# EAGLE design rev1 (EAGLE 7.1.0)
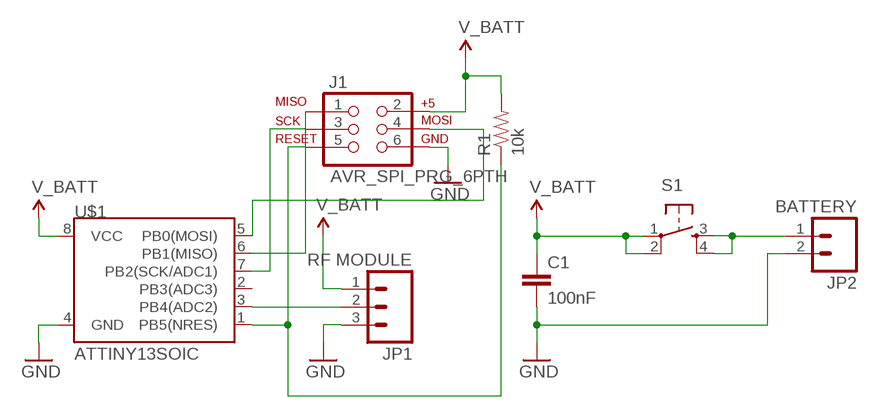
[diagram p0: schematic, sheet 1]

## Parts
C1  100nF  CAP1206  [1206]
J1  AVR_SPI_PRG_6PTH  [2X3]
JP1  RF MODULE  M03PTH  [1X03]
JP2  BATTERY  M02PTH  [1X02]
R1  10k  RESISTOR1206  [1206]
S1  TAC_SWITCHPTH  [TACTILE-PTH]
U$1  ATTINY13SOIC  [SO08]

## Nets
GND: C1.2 J1.6 JP1.3 JP2.2 U$1.4(GND)
N$1: JP1.2 U$1.3(PB4(ADC2))
N$3: JP2.1 S1.3 S1.4
N$4: J1.5 R1.1 U$1.1(PB5(NRES))
N$5: J1.3 U$1.7(PB2(SCK/ADC1))
N$6: J1.1 U$1.6(PB1(MISO))
N$7: J1.4 U$1.5(PB0(MOSI))
V_BATT: C1.1 J1.2 JP1.1 R1.2 S1.1 S1.2 U$1.8(VCC)
Unconnected: U$1.2(PB3(ADC3))

## Library data of the parts
C1 = SparkFun-Capacitors:CAP: Capacitor Standard 0603 ceramic capacitor, and 0.1" leaded capacitor.
J1 = SparkFun-Connectors:AVR_SPI_PRG_6: AVR ISP 6 Pin This is the reduced ISP connector for AVR programming. Common on Arduino. This footprint will take up less PCB space and can be used with a 10-pin to 6-pin adapter such as SKU: BOB-08508 **Special note about "TEST_POINT" package. The stop mask is on the top side, so if you want your programming test points to be on the bottom of your board, make sure to place this package on the bottom side of the board. This also ensure that the orientation to program from the bottom side will be correct.
JP1 = SparkFun-Connectors:M03: Header 3 Standard 3-pin 0.1" header. Use with straight break away headers (SKU : PRT-00116), right angle break away headers (PRT-00553), swiss pins (PRT-00743), machine pins (PRT-00117), and female headers (PRT-00115). Molex polarized connector foot print use with SKU : PRT-08232 with associated crimp pins and housings.
JP2 = SparkFun-Connectors:M02: Standard 2-pin 0.1" header. Use with - straight break away headers ( PRT-00116) - right angle break away headers (PRT-00553) - swiss pins (PRT-00743) - machine pins (PRT-00117) - female headers (PRT-00115) Molex polarized connector foot print use with: PRT-08233 with associated crimp pins and housings. 2.54_SCREWTERM for use with PRT-10571. 3.5mm Screw Terminal footprints for PRT-08084 5mm Screw Terminal footprints for use with PRT-08432
R1 = SparkFun-Resistors:RESISTOR: Resistor Basic schematic elements and footprints for 0603, 1206, and PTH resistors.
S1 = SparkFun-Electromechanical:TAC_SWITCH: Momentary Switch Button commonly used for reset or general input. Spark Fun Electronics SKU : COM-00097 SMT- SWCH-08247
U$1 = SparkFun-DigitalIC:ATTINY13: Atmel 8-pin 1kB flash uC

## Board
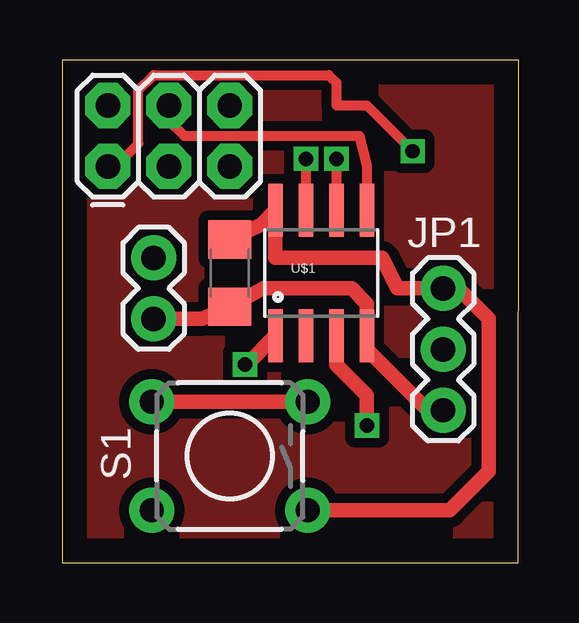
[diagram p1: board, top side]
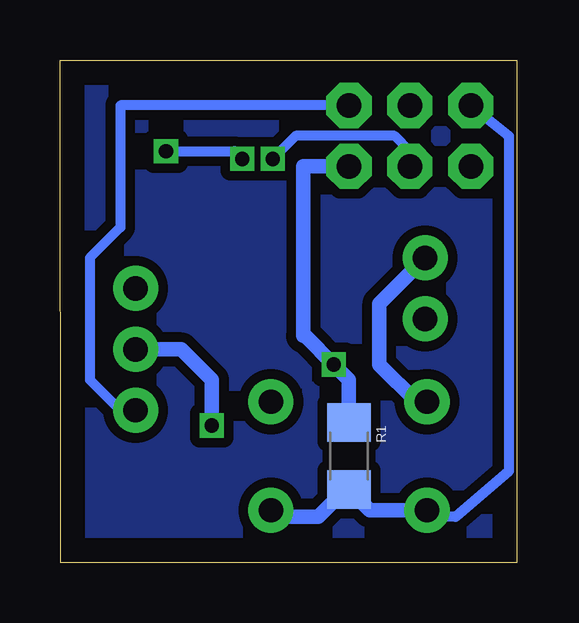
[diagram p2: board, bottom side, seen from below]

Size 19.02 x 20.95 mm. Coordinates in mm from the lower left corner, seen from the top.
Outline: 0,0 19,0 19.02,20.95 0,20.95 0,0
Copper layers (1*16): Top 0.035mm / dielectric 1.5mm / Bottom 0.035mm
Design rules "default": minimum track width 10mil, minimum drill 24mil, track to track 8mil, track to pad 8mil, pad to pad 8mil, via to via 8mil, smd to smd 8mil, copper to edge 40mil, drill to drill 8mil, minimum pad ring 10mil, minimum via ring 8mil, stop-mask expansion 4mil, vias tented up to drill 0mil, thermal gap 10mil

### Footprints (pad centres in the part's own frame; a part is rotated, then mirrored left to right if it is on the bottom)
1206 = smd 1.6 x 1.8: 1 -1.4,0; 2 1.4,0
2X3 = drill 1.016 pad 1.88 octagon: 1 0,0; 2 0,2.54; 3 2.54,0; 4 2.54,2.54; 5 5.08,0; 6 5.08,2.54
1X03 = drill 1.016 pad 1.88: 1 0,0; 2 2.54,0; 3 5.08,0
1X02 = drill 1.016 pad 1.88: 1 0,0; 2 2.54,0
TACTILE-PTH = drill 1.016 pad 1.88: 1 -3.251,2.261; 2 3.251,2.261; 3 -3.251,-2.261; 4 3.251,-2.261
SO08 = smd 0.61 x 2.21: 1 -1.905,-2.616; 2 -0.635,-2.616; 3 0.635,-2.616; 4 1.905,-2.616; 5 1.905,2.616; 6 0.635,2.616; 7 -0.635,2.616; 8 -1.905,2.616

### Placement (x,y rotation side)
C1  6.99,12.06 270 top
J1  1.91,16.51 0 top
JP1  15.88,11.43 270 top
JP2  3.81,12.7 270 top
R1  6.99,4.45 270 bottom
S1  6.99,4.45 180 top
U$1  10.79,12.06 0 top

### Tracks (layer width: path | path; a pad name or v marks a point on that pad's centre or on a via)
GND
  Top 0.61: JP2.2 5.84,10.16 C1.2 8.38,11.43 12.06,11.43 12.7,10.79 U$1.4 12.7,8.89 15.24,6.35 JP1.3
  Bottom 0.406: J1.6 16.51,19.05 16.51,13.97 17.78,12.7 17.78,7.62 16.51,6.35 JP1.3
N$1  (via drill 0.6)
  Top 0.61: U$1.3 11.43,8.26 12.7,6.99 v12.7,5.71
  Bottom 0.61: v12.7,5.71 12.7,7.62 13.97,8.89 JP1.2
N$2
  pour Bottom (isolate 0.406): 0,20.95 19.05,20.95 19.05,0 0,0
N$3
  Top 0.61: S1.3 S1.4
  Bottom 0.61: S1.4 4.17,6.71 5.71,8.26 5.71,10.79 JP2.1
N$4  (via drill 0.6)
  Top 0.61: v7.62,8.26 7.7,8.26 U$1.1
  Bottom 0.61: R1.1 6.99,7.62 v7.62,8.26 | 8.08,8.71 v7.62,8.26 | J1.5 8.89,16.51 U$1.1 8.81,9.45 v7.62,8.26
N$5  (via drill 0.6)
  Top 0.406: v10.16,16.83 U$1.7
  Bottom 0.406: J1.3 4.45,17.14 5.08,17.78 9.21,17.78 v10.16,16.83
N$6  (via drill 0.6)
  Top 0.406: J1.1 2.22,16.51 3.17,17.46 3.17,19.68 3.81,20.32 11.11,20.32 11.43,20 11.43,19.05 12.7,19.05 v14.61,17.14 | v11.43,16.83 U$1.6
  Bottom 0.406: v14.61,17.14 11.75,17.14 v11.43,16.83
N$7
  Top 0.406: J1.4 4.45,18.41 5.08,17.78 12.38,17.78 12.7,16.51 U$1.5
N$8
  pour Top (isolate 0.406): 0,20.95 19.05,20.95 19.05,0 0,0
V_BATT
  Top 0.61: C1.1 8.31,14.1 U$1.8 8.89,12.7 13.34,12.7 13.97,11.43 JP1.1 16.51,11.43 17.78,10.16 17.78,3.81 16.15,2.18 S1.1
  Bottom 0.406: J1.2 0.32,17.78 0.32,3.81 2.54,1.91 3.45,1.91 S1.2
  Bottom 0.61: S1.2 6.12,2.18 R1.2 7.12,3.04 8.26,1.91 9.96,1.91 S1.1

### Text on the board
bDocu: rev 0x1 | Moderato / Pass | 2014